# Altium schematic sheet CAN0.SchDoc
size A4
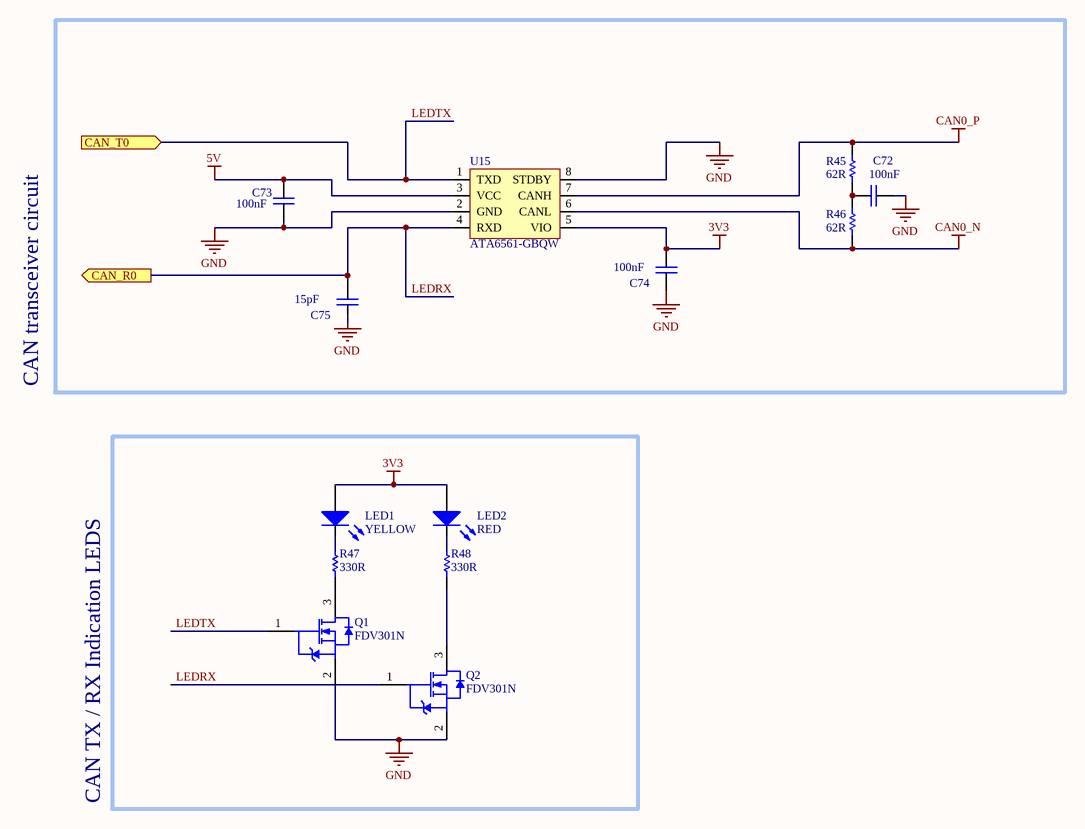
[diagram p0: CAN0.SchDoc]

## Parts
C72  value 100nF  [C1206]  (hidden comment: C1206C106K3PACTU)
C73  value 100nF  [C1206]  (hidden comment: C1206C106K3PACTU)
C74  value 100nF  [C1206]  (hidden comment: C1206C106K3PACTU)
C75  value 15pF  [C1206]  (hidden comment: C1206C106K3PACTU)
LED1  YELLOW  [0603_A]
LED2  RED  [0603_A]
Q1  FDV301N  [FAIR-SOT23-3_V]
Q2  FDV301N  [FAIR-SOT23-3_V]
R45  62R  [RESC0603(1608)_L]
R46  62R  [RESC0603(1608)_L]
R47  330R  [RESC0603(1608)_L]
R48  330R  [RESC0603(1608)_L]
U15  ATA6561-GBQW  [LME49721MA/NOPB]

## Ports
CAN_R0 (out), CAN_T0 (in)

## Nets
3V3: C74.2 LED1.2(A) LED2.2(A) U15.5(VIO)
5V: C73.2 U15.3(VCC)
CAN0_N: R46.2 U15.6(CANL)
CAN0_P: R45.1 U15.7(CANH)
GND: C72.1 C73.1 C74.1 C75.1 Q1.2(S) Q2.2(S) U15.2(GND) U15.8(STDBY)
LEDRX: C75.2 Q2.1(G) U15.4(RXD) ; port CAN_R0
LEDTX: Q1.1(G) U15.1(TXD) ; port CAN_T0
NetC72_2: C72.2 R45.2 R46.1
NetLED1_1: LED1.1(K) R47.1
NetLED2_1: LED2.1(K) R48.1
NetQ1_3: Q1.3(D) R47.2
NetQ2_3: Q2.3(D) R48.2

## Notes on the sheet
- CAN transceiver circuit
- CAN TX / RX Indication LEDS

## Library data of the parts
C72-C75 = C1206C106K3PACTU: C1206
LED1 LED2 = CMP-1426-00001-1: SMD mono-color Chip LED, WL-SMCW, Red; Manufacturer: Wuerth Elektronik; PartNumber: 150060RS75000; Color: Red; PackageReference: 0603_A; ComponentLink2URL: http://katalog.we-online.com/led/datasheet/150060RS75000.pdf; ComponentLink1URL: http://www.we-online.com; ComponentLink1Description: Manufacturer URL; ComponentLink2Description: Datasheet
Q1 Q2 = CMP-2000-04935-1: Digital FET, N-Channel, 0.35 W, 25 V, -55 to 150 degC, 3-Pin SOT23, RoHS, Tape and Reel; Manufacturer: Fairchild; Rds(on) Test Voltage Vgs: 2.7V; Threshold Voltage Vgs Typ: 850mV; Voltage Vds Typ: 25V; Transistor Case Style: SOT-23; Reel Quantity: 3000; Voltage Vgs Rds on Measurement: 4.5V; Power Dissipation Pd: 350mW; Continuous Drain Current Id: 220mA; Transistor Polarity: NChannel; No. of Transistors: 1; Package Version: Rev. 12, 03/2016; Voltage Vgs th Max: 1.5V; ESD HBM: 6kV; Pulse Current Idm: 500mA; Current Temperature: 25degC; On Resistance Rds(on): 5ohm; External Depth: 2.5mm; SMD Marking: 301; No. of Pins: 3; External Width: 3.05mm; SVHC: NoSVHC(19-Dec-2012); External Length / Height: 1.12mm; Termination Type: SMD; Package Reference: SOT23-3; Package URL: http://www.fairchildsemi.com/dwg/MA/MA03D.pdf; Voltage Vgs Max: 850mV; Drain Source Voltage Vds: 25V; Operating Temperature Max: 150degC; Package Description: 3-Pin Small Outline Transistor, Body 2.92 x 1.325 mm, Pitch 0.95 mm; Operating Temperature Min: -55degC; Datasheet Version: Jun-09; Tape Width: 8mm; Full Power Rating Temperature: 25degC; Datasheet URL: https://datasheet.ciiva.com/8114/fdv301n-8114688.pdf; Package / Case: SOT-23; Manufacturer URL: https://www.fairchildsemi.com/; Current Id Max: 220mA; Operating Temperature Range: -55degCto+150degC
R45-R48 = CMP-1012-00062-1: 330R 0.1W 5% 0603 (1608 Metric)  SMD; Value: 330.00 Ohm; Case-EIA: 0603; Case-Metric: 1608; Tolerance: 5 %; Power: 0.1 W; Technology: SMT